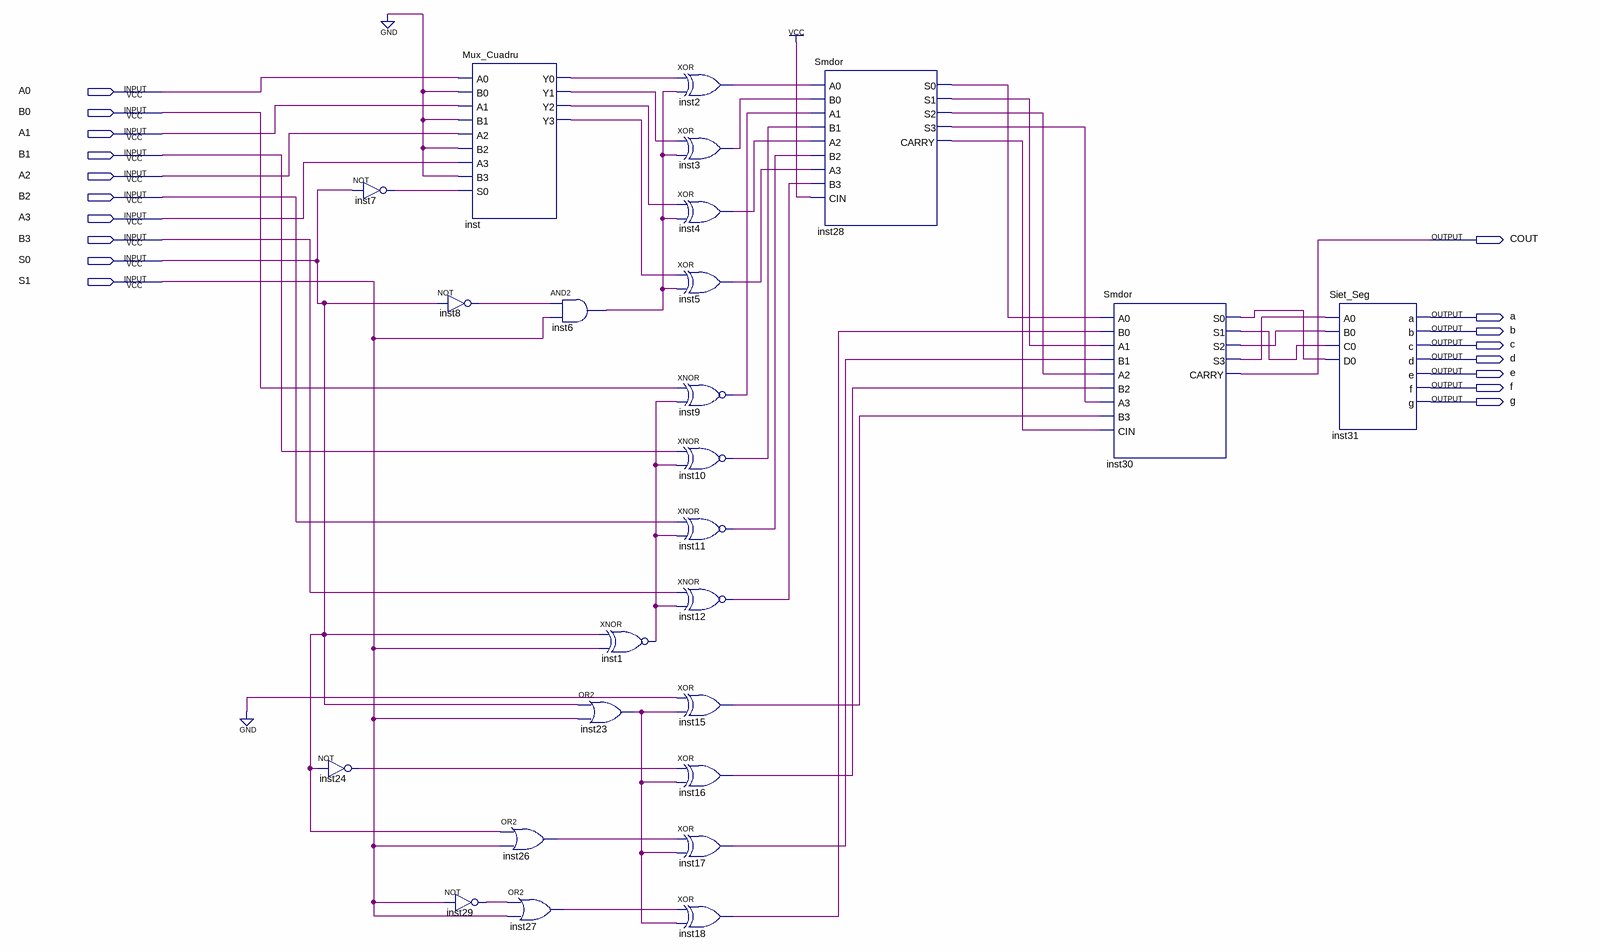
[diagram p0: schematic sheet]
// Quartus schematic Part_Arit.bdf as structural Verilog: 25 symbols, 18 pins
module Part_Arit (
  input  A0,
  input  B0,
  input  A1,
  input  B1,
  input  A2,
  input  B2,
  input  A3,
  input  B3,
  input  S0,
  input  S1,
  output COUT,
  output a,
  output b,
  output c,
  output d,
  output e,
  output f,
  output g
);

  wire inst1_out, inst2_out, inst3_out, inst4_out, inst5_out, inst6_out, inst7_out, inst8_out, inst9_out,
       inst10_out, inst11_out, inst12_out, inst15_out, inst16_out, inst17_out, inst18_out, inst23_out,
       inst24_out, inst26_out, inst27_out, inst28_carry, inst28_s0, inst28_s1, inst28_s2, inst28_s3,
       inst29_out, inst30_s0, inst30_s1, inst30_s2, inst30_s3, inst_y0, inst_y1, inst_y2, inst_y3;

  not inst24 (inst24_out, S0);
  not inst7 (inst7_out, S0);
  not inst8 (inst8_out, S0);
  not inst29 (inst29_out, S1);
  Mux_Cuadru inst (
    .A0(A0), .B0(1'b0), .A1(A1), .B1(1'b0), .A2(A2), .B2(1'b0), .A3(A3), .B3(1'b0), .S0(inst7_out),
    .Y0(inst_y0), .Y1(inst_y1), .Y2(inst_y2), .Y3(inst_y3));
  or inst26 (inst26_out, S0, S1);
  or inst27 (inst27_out, inst29_out, S1);
  and inst6 (inst6_out, inst8_out, S1);
  xnor inst1 (inst1_out, S0, S1);
  or inst23 (inst23_out, S0, S1);
  xor inst2 (inst2_out, inst_y0, inst6_out);
  xor inst3 (inst3_out, inst_y1, inst6_out);
  xor inst4 (inst4_out, inst_y2, inst6_out);
  xor inst5 (inst5_out, inst_y3, inst6_out);
  xnor inst9 (inst9_out, B0, inst1_out);
  xnor inst10 (inst10_out, B1, inst1_out);
  xnor inst11 (inst11_out, B2, inst1_out);
  xnor inst12 (inst12_out, B3, inst1_out);
  xor inst15 (inst15_out, 1'b0, inst23_out);
  xor inst16 (inst16_out, inst24_out, inst23_out);
  xor inst17 (inst17_out, inst26_out, inst23_out);
  xor inst18 (inst18_out, inst27_out, inst23_out);
  Smdor inst28 (
    .A0(inst2_out), .B0(inst3_out), .A1(inst9_out), .B1(inst10_out), .A2(inst4_out), .B2(inst11_out),
    .A3(inst5_out), .B3(inst12_out), .CIN(1'b1), .S0(inst28_s0), .S1(inst28_s1), .S2(inst28_s2),
    .S3(inst28_s3), .CARRY(inst28_carry));
  Smdor inst30 (
    .A0(inst28_s0), .B0(inst18_out), .A1(inst28_s1), .B1(inst17_out), .A2(inst28_s2), .B2(inst16_out),
    .A3(inst28_s3), .B3(inst15_out), .CIN(inst28_carry), .S0(inst30_s0), .S1(inst30_s1), .S2(inst30_s2),
    .S3(inst30_s3), .CARRY(COUT));
  Siet_Seg inst31 (
    .A0(inst30_s3), .B0(inst30_s2), .C0(inst30_s1), .D0(inst30_s0), .a(a), .b(b), .c(c), .d(d), .e(e), .f(f),
    .g(g));
endmodule
